# EasyEDA schematic SCH_halloween-prokect_2024-10-07.json
TITLE: Sheet_1; REV: 1.0; Date: 2024-10-07; Sheet: 1/1; Drawn By: alecsis; Company: Your Company
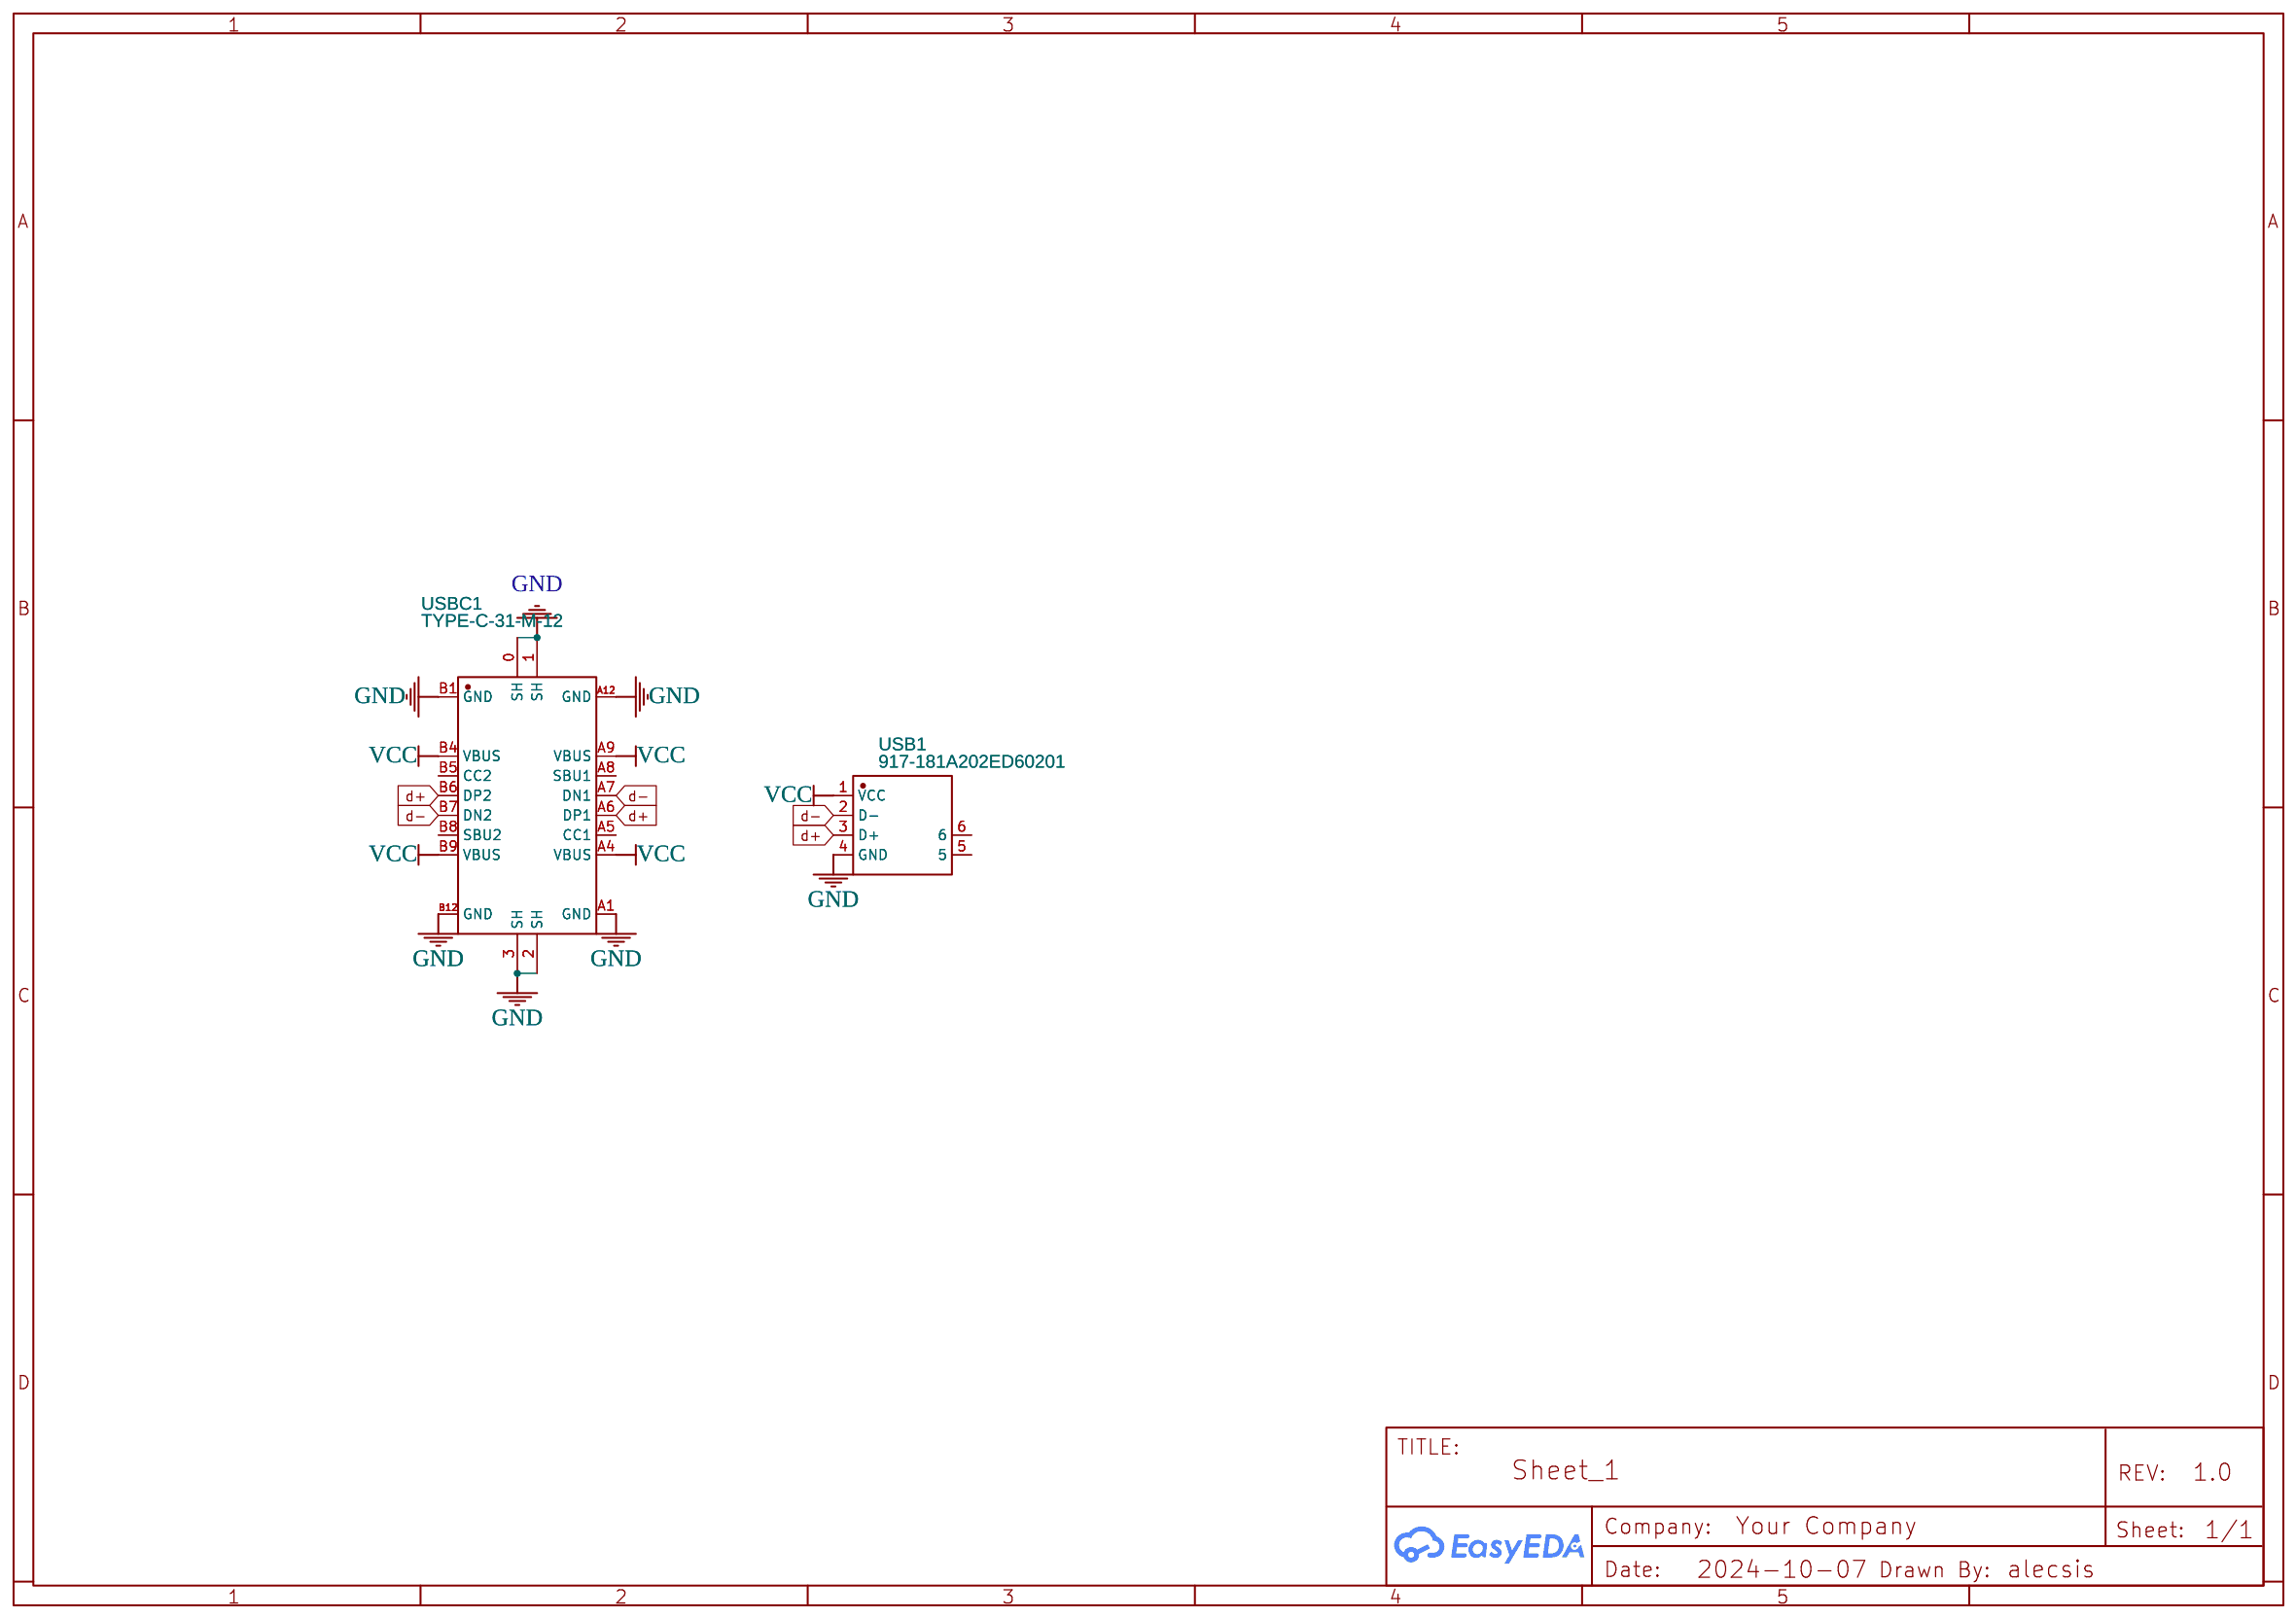
[diagram p0: schematic sheet]

## Parts
USB1  917-181A202ED60201  [USB-A-TH_917-181A202ED60201]
USBC1  TYPE-C-31-M-12  [USB-C_SMD-TYPE-C-31-M-12]

## Library data of the parts
USB1 = 917-181A202ED60201: JLCPCB Part Class: Extended Part; Contributor: LCSC; Supplier: LCSC; Supplier Part: C2763084; Manufacturer: 精拓金
USBC1 = TYPE-C-31-M-12: Contributor: LCSC; Supplier: LCSC; Supplier Part: C165948; Manufacturer: 韩国韩荣; JLCPCB Part Class: Extended Part

## Nets
GND: USB1.4(GND) USBC1.0(SH) USBC1.1(SH) USBC1.2(SH) USBC1.3(SH) USBC1.A1(GND) USBC1.A12(GND) USBC1.B1(GND) USBC1.B12(GND)
VCC: USB1.1(VCC) USBC1.A4(VBUS) USBC1.A9(VBUS) USBC1.B4(VBUS) USBC1.B9(VBUS)
d+: USB1.3(D+) USBC1.A6(DP1) USBC1.B6(DP2)
d-: USB1.2(D-) USBC1.A7(DN1) USBC1.B7(DN2)

Not connected (* = marked no-connect by the designer): USB1 5 6; USBC1 A5(CC1) A8(SBU1) B5(CC2) B8(SBU2)
